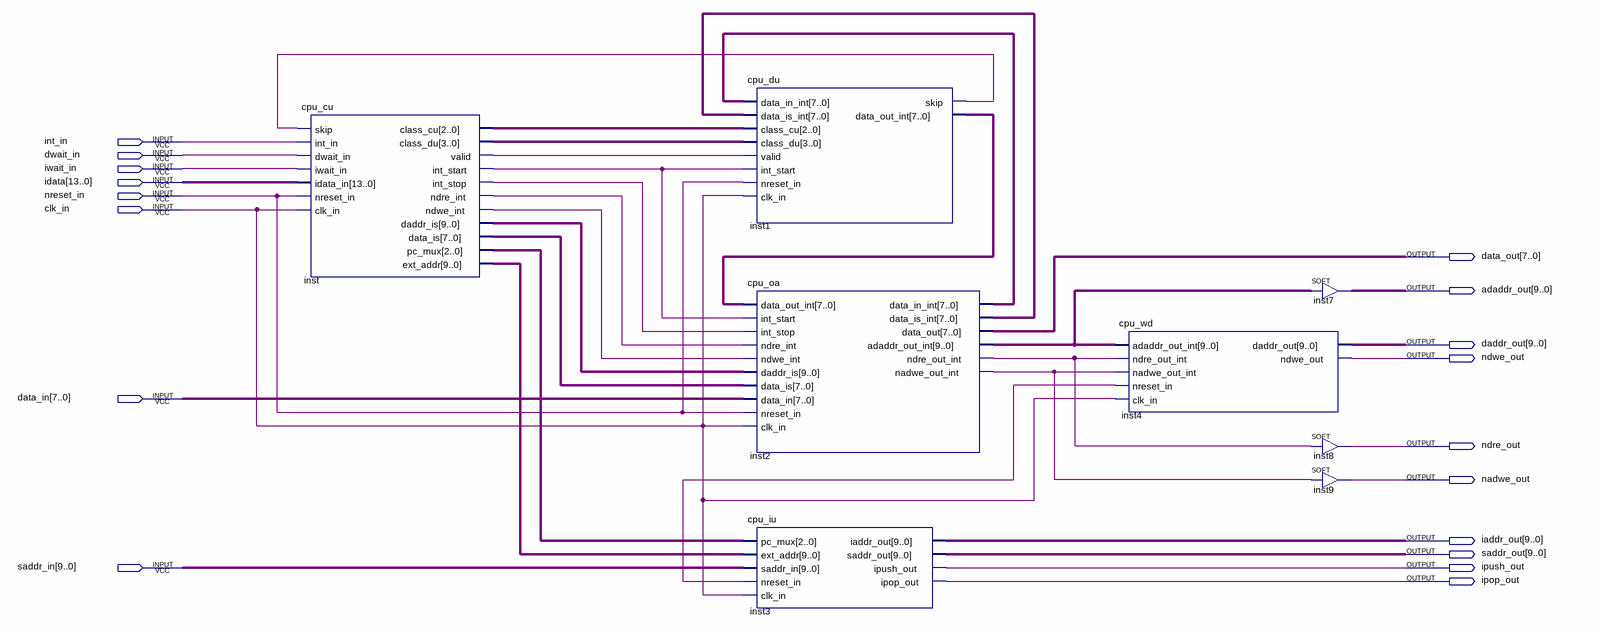
[diagram p0: schematic sheet]
// Quartus schematic arch_cpu.bdf as structural Verilog: 8 symbols, 18 pins
module arch_cpu (
  input  int_in,
  input  dwait_in,
  input  iwait_in,
  input  [13:0] idata,
  input  nreset_in,
  input  clk_in,
  input  [7:0] data_in,
  input  [9:0] saddr_in,
  output [7:0] data_out,
  output [9:0] adaddr_out,
  output [9:0] daddr_out,
  output ndwe_out,
  output ndre_out,
  output nadwe_out,
  output [9:0] iaddr_out,
  output [9:0] saddr_out,
  output ipush_out,
  output ipop_out
);

  wire inst1_skip, inst2_nadwe_out_int, inst2_ndre_out_int, inst_int_start, inst_int_stop, inst_ndre_int,
       inst_ndwe_int, inst_valid, undriven;
  wire [2:0] inst_class_cu, inst_pc_mux;
  wire [3:0] inst_class_du;
  wire [7:0] inst1_data_out_int, inst2_data_in_int, inst2_data_is_int, inst_data_is;
  wire [9:0] inst2_adaddr_out_int, inst_daddr_is, inst_ext_addr;

  cpu_cu inst (
    .skip(inst1_skip), .int_in(int_in), .dwait_in(dwait_in), .iwait_in(iwait_in), .idata_in(idata),
    .nreset_in(nreset_in), .clk_in(clk_in), .class_cu(inst_class_cu), .class_du(inst_class_du),
    .valid(inst_valid), .int_start(inst_int_start), .int_stop(inst_int_stop), .ndre_int(inst_ndre_int),
    .ndwe_int(inst_ndwe_int), .daddr_is(inst_daddr_is), .data_is(inst_data_is), .pc_mux(inst_pc_mux),
    .ext_addr(inst_ext_addr));
  cpu_du inst1 (
    .data_in_int(inst2_data_in_int), .data_is_int(inst2_data_is_int), .class_cu(inst_class_cu),
    .class_du(inst_class_du), .valid(inst_valid), .int_start(inst_int_start), .nreset_in(nreset_in),
    .clk_in(clk_in), .skip(inst1_skip), .data_out_int(inst1_data_out_int));
  cpu_oa inst2 (
    .data_out_int(inst1_data_out_int), .int_start(inst_int_start), .int_stop(inst_int_stop),
    .ndre_int(inst_ndre_int), .ndwe_int(inst_ndwe_int), .daddr_is(inst_daddr_is), .data_is(inst_data_is),
    .data_in(data_in), .nreset_in(nreset_in), .clk_in(clk_in), .data_in_int(inst2_data_in_int),
    .data_is_int(inst2_data_is_int), .data_out(data_out), .adaddr_out_int(inst2_adaddr_out_int),
    .ndre_out_int(inst2_ndre_out_int), .nadwe_out_int(inst2_nadwe_out_int));
  cpu_iu inst3 (
    .pc_mux(inst_pc_mux), .ext_addr(inst_ext_addr), .saddr_in(saddr_in), .nreset_in(undriven),
    .clk_in(clk_in), .iaddr_out(iaddr_out), .saddr_out(saddr_out), .ipush_out(ipush_out), .ipop_out(ipop_out));
  cpu_wd inst4 (
    .adaddr_out_int(inst2_adaddr_out_int), .ndre_out_int(inst2_ndre_out_int),
    .nadwe_out_int(inst2_nadwe_out_int), .nreset_in(undriven), .clk_in(clk_in), .daddr_out(daddr_out),
    .ndwe_out(ndwe_out));
  SOFT inst7[9:0] (.IN(inst2_adaddr_out_int), .OUT(adaddr_out));
  SOFT inst8 (.IN(inst2_ndre_out_int), .OUT(ndre_out));
  SOFT inst9 (.IN(inst2_nadwe_out_int), .OUT(nadwe_out));
endmodule
